# Altium schematic sheet Three_Phase_Inverter.SchDoc
size A4; SheetNumber: 4; SheetTotal: 5
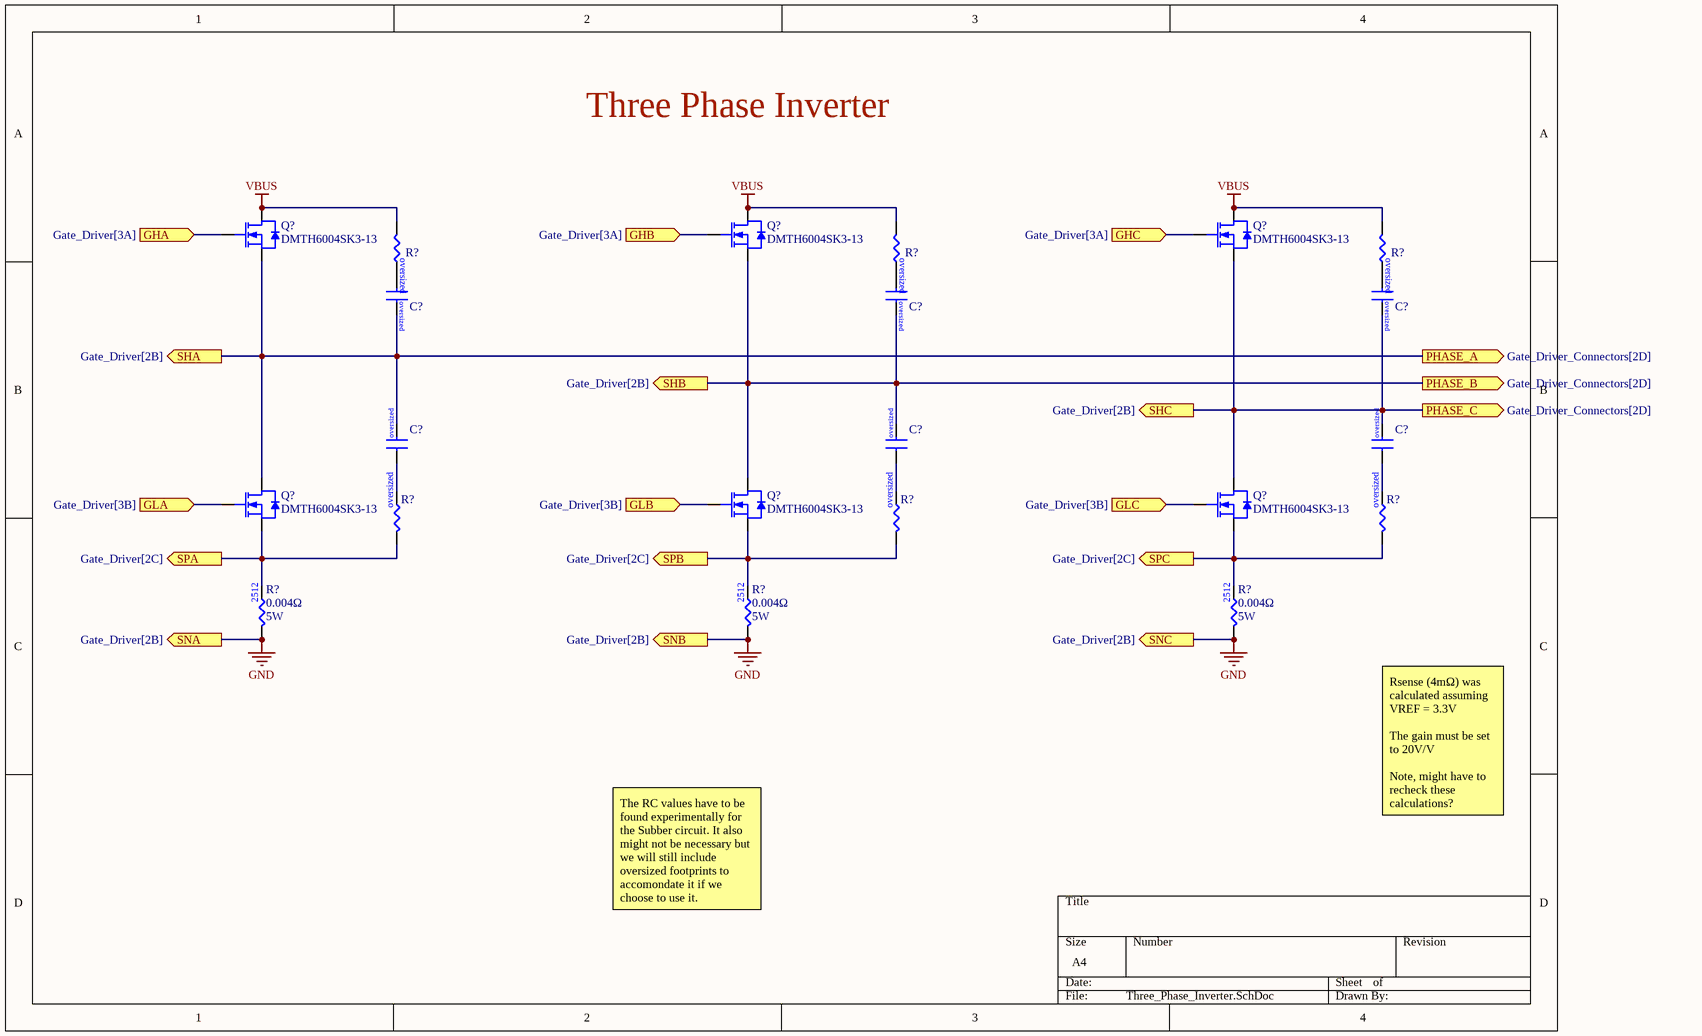
[diagram p0: Three_Phase_Inverter.SchDoc]

## Parts
(Parts that share a designator on the sheet are numbered #1, #2 ... from top to bottom, then left to right.)
C?#1  EMPTY PART FOR RC SNUBBER CIRCUIT  [RES/CAP_OVERSIZED]  (value not drawn)
C?#2  EMPTY PART FOR RC SNUBBER CIRCUIT  [RES/CAP_OVERSIZED]  (value not drawn)
C?#3  EMPTY PART FOR RC SNUBBER CIRCUIT  [RES/CAP_OVERSIZED]  (value not drawn)
C?#4  EMPTY PART FOR RC SNUBBER CIRCUIT  [RES/CAP_OVERSIZED]  (value not drawn)
C?#5  EMPTY PART FOR RC SNUBBER CIRCUIT  [RES/CAP_OVERSIZED]  (value not drawn)
C?#6  EMPTY PART FOR RC SNUBBER CIRCUIT  [RES/CAP_OVERSIZED]  (value not drawn)
Q?#1  Manufacturer Part Number 1: DMTH6004SK3-13  [D-PAK]  (hidden comment: NMOS_60V_100A)
Q?#2  Manufacturer Part Number 1: DMTH6004SK3-13  [D-PAK]  (hidden comment: NMOS_60V_100A)
Q?#3  Manufacturer Part Number 1: DMTH6004SK3-13  [D-PAK]  (hidden comment: NMOS_60V_100A)
Q?#4  Manufacturer Part Number 1: DMTH6004SK3-13  [D-PAK]  (hidden comment: NMOS_60V_100A)
Q?#5  Manufacturer Part Number 1: DMTH6004SK3-13  [D-PAK]  (hidden comment: NMOS_60V_100A)
Q?#6  Manufacturer Part Number 1: DMTH6004SK3-13  [D-PAK]  (hidden comment: NMOS_60V_100A)
R?#1  RES_OVERSIZED  [RES/CAP_OVERSIZED]  (value not drawn)
R?#2  RES_OVERSIZED  [RES/CAP_OVERSIZED]  (value not drawn)
R?#3  RES_OVERSIZED  [RES/CAP_OVERSIZED]  (value not drawn)
R?#4  RES_OVERSIZED  [RES/CAP_OVERSIZED]  (value not drawn)
R?#5  RES_OVERSIZED  [RES/CAP_OVERSIZED]  (value not drawn)
R?#6  RES_OVERSIZED  [RES/CAP_OVERSIZED]  (value not drawn)
R?#7  value 0.004Ω  Power: 5W  [RESC6532X75N]  (hidden comment: RES_4mΩ_2512_1%_5W)
R?#8  value 0.004Ω  Power: 5W  [RESC6532X75N]  (hidden comment: RES_4mΩ_2512_1%_5W)
R?#9  value 0.004Ω  Power: 5W  [RESC6532X75N]  (hidden comment: RES_4mΩ_2512_1%_5W)

## Ports
GHA (in, see Gate_Driver[3A]), GHB (in, see Gate_Driver[3A]), GHC (in, see Gate_Driver[3A]), GLA (in, see Gate_Driver[3B]), GLB (in, see Gate_Driver[3B]), GLC (in, see Gate_Driver[3B]), PHASE_A (out, see Gate_Driver_Connectors[2D]), PHASE_B (out, see Gate_Driver_Connectors[2D]), PHASE_C (out, see Gate_Driver_Connectors[2D]), SHA (out, see Gate_Driver[2B]), SHB (out, see Gate_Driver[2B]), SHC (out, see Gate_Driver[2B]), SNA (out, see Gate_Driver[2B]), SNB (out, see Gate_Driver[2B]), SNC (out, see Gate_Driver[2B]), SPA (out, see Gate_Driver[2C]), SPB (out, see Gate_Driver[2C]), SPC (out, see Gate_Driver[2C])

## Nets
GND: R?#7.1 R?#8.1 R?#9.1 ; port SNA, port SNB, port SNC
VBUS: Q?#1.1(Drain) Q?#2.1(Drain) Q?#3.1(Drain) R?#1.1 R?#2.1 R?#3.1
GHA: Q?#1.2(Gate) ; port GHA
GHB: Q?#2.2(Gate) ; port GHB
GHC: Q?#3.2(Gate) ; port GHC
GLA: Q?#4.2(Gate) ; port GLA
GLB: Q?#5.2(Gate) ; port GLB
GLC: Q?#6.2(Gate) ; port GLC
PHASE_A: C?#1.2 C?#4.2 Q?#1.3(Source) Q?#4.1(Drain) ; port PHASE_A, port SHA
PHASE_B: C?#2.2 C?#5.2 Q?#2.3(Source) Q?#5.1(Drain) ; port PHASE_B, port SHB
PHASE_C: C?#3.2 C?#6.2 Q?#3.3(Source) Q?#6.1(Drain) ; port PHASE_C, port SHC
SPA: Q?#4.3(Source) R?#4.1 R?#7.2 ; port SPA
SPB: Q?#5.3(Source) R?#5.1 R?#8.2 ; port SPB
SPC: Q?#6.3(Source) R?#6.1 R?#9.2 ; port SPC
NetC?#1_1: C?#1.1 R?#1.2
NetC?#2_1: C?#2.1 R?#2.2
NetC?#3_1: C?#3.1 R?#3.2
NetC?#4_1: C?#4.1 R?#4.2
NetC?#5_1: C?#5.1 R?#5.2
NetC?#6_1: C?#6.1 R?#6.2

## Notes on the sheet
- Three Phase Inverter
- Rsense (4mΩ) was calculated assuming VREF = 3.3V
  The gain must be set to 20V/V
  Note, might have to recheck these calculations?
- The RC values have to be found experimentally for the Subber circuit. It also might not be necessary but we will still include oversized footprints to accomondate it if we choose to use it.
- (in symbol CAP_OVERSIZED) oversized
- (in symbol RES_4mΩ_2512_1%_5W) 2512
- (in symbol RES_OVERSIZED) oversized

## Library data of the parts
C?#1-C?#6 = CAP_OVERSIZED: EMPTY PART FOR RC SNUBBER CIRCUIT (I just wanted the symbol and footprint to place)
Q?#1-Q?#6 = NMOS_60V_100A: MOSFET N-CH 60V 100A DPAK; Manufacturer 1: Diodes Incorporated; FET Type: N-Channel; Vgs (Max): 20V; Power Dissipation (Max): 180W; Supplier 1: Digi-Key; Supplier Part Number 1: DMTH6004SK3-13DICT-ND; Vdss: 60V; Supplier Device Package: D-PAK (TO-252); Id: 100A
R?#1-R?#6 = RES_OVERSIZED: EMPTY PART FOR RC SNUBBER CIRCUIT (I just wanted the symbol and footprint to place)
R?#7-R?#9 = RES_4mΩ_2512_1%_5W: RES 0.004 OHM 1% 2W 2512; Manufacturer 1: KOA Speer Electronics, Inc.; Manufacturer Part Number 1: TLR3APDTE4L00F50; Supplier 1: Digi-Key; Supplier Part Number 1: 2019-TLR3APDTE4L00F50CT-ND